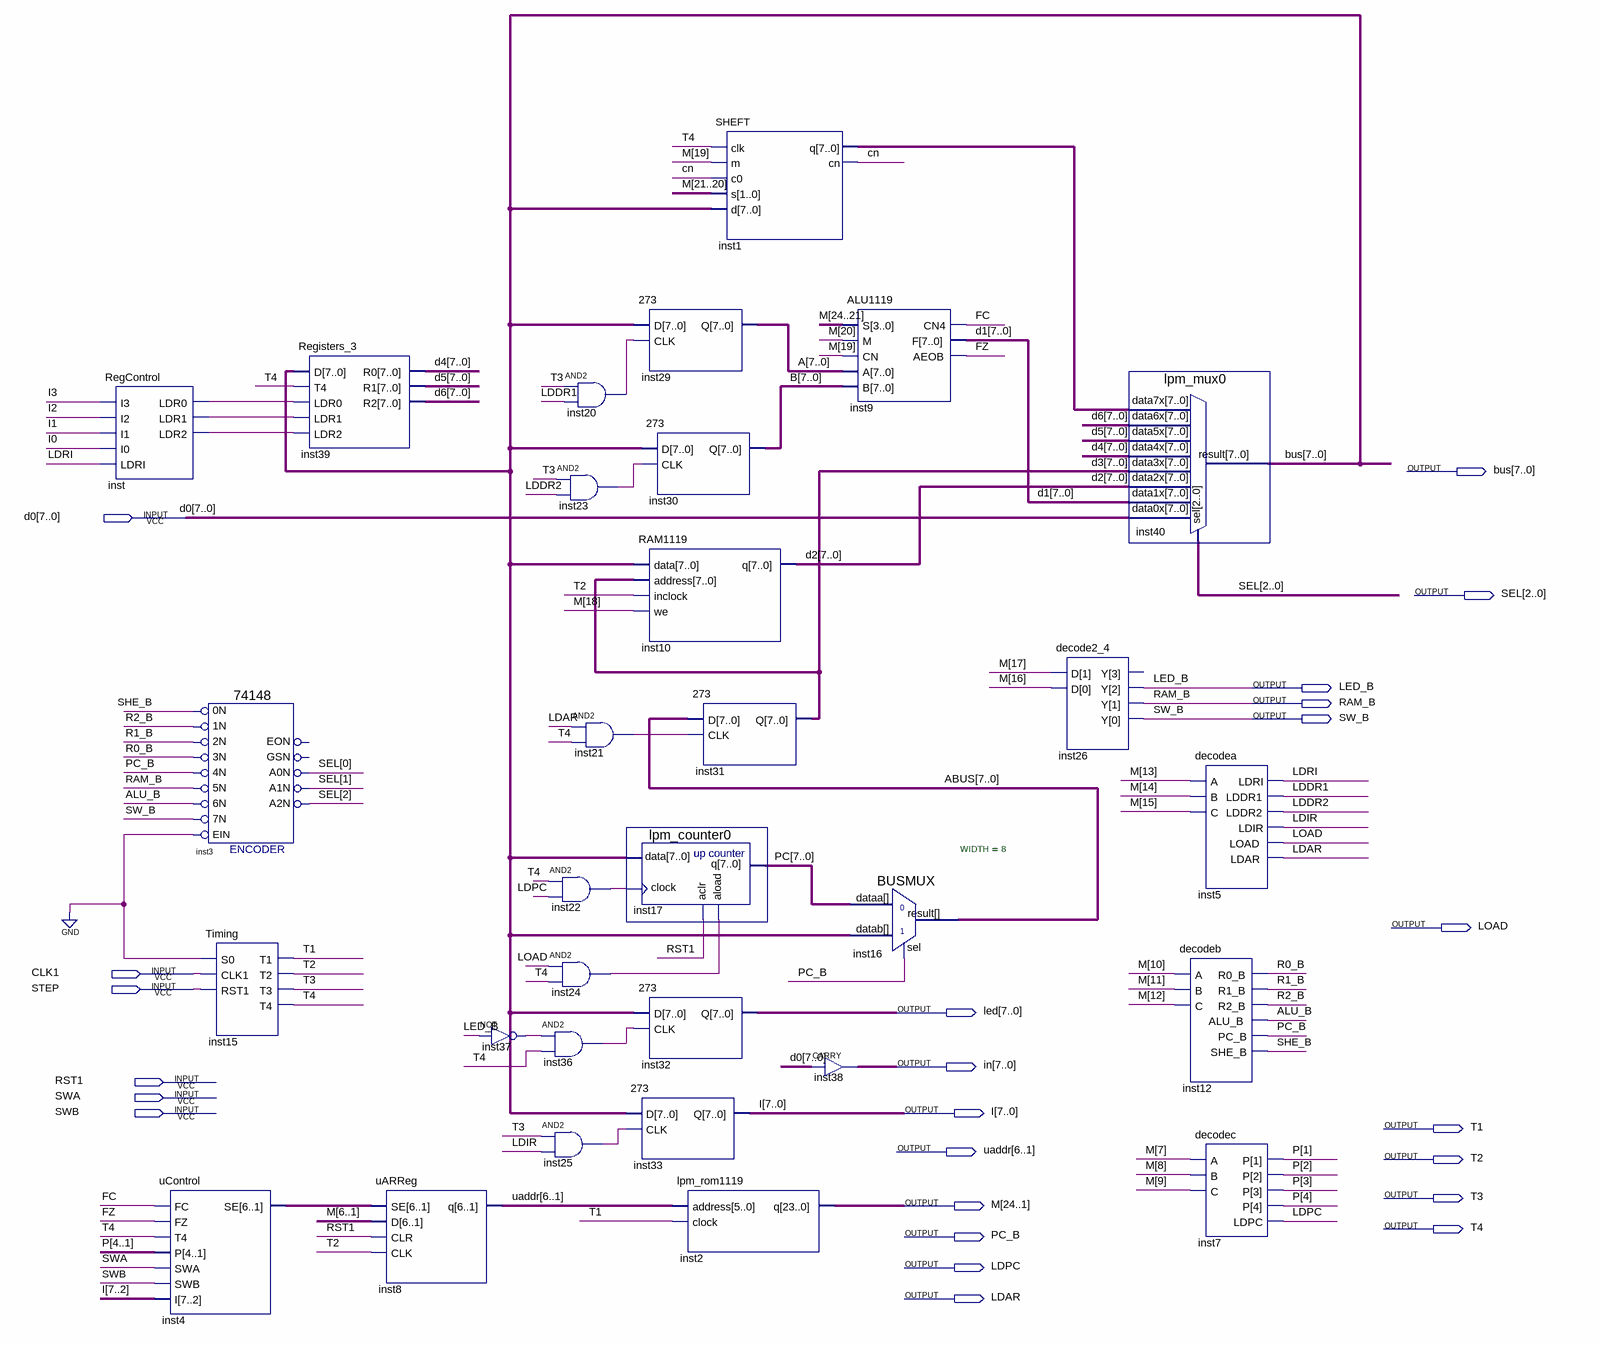
[diagram p0: schematic sheet]
// Quartus schematic move_computer1119.bdf as structural Verilog: 31 symbols, 24 pins
module move_computer1119 (
  input  [7:0] d0,
  input  CLK1,
  input  STEP,
  input  RST1,
  input  SWA,
  input  SWB,
  output [7:0] bus,
  output [2:0] SEL,
  output LED_B,
  output RAM_B,
  output SW_B,
  output LOAD,
  output [7:0] led,
  output [7:0] in,
  output [7:0] I,
  output T1,
  output [6:1] uaddr,
  output T2,
  output T3,
  output [24:1] M,
  output T4,
  output PC_B,
  output LDPC,
  output LDAR
);

  wire ALU_B, cn, FC, FZ, inst20_out, inst21_out, inst22_out, inst23_out, inst24_out, inst25_out, inst36_out,
       inst37_out, inst_ldr0, inst_ldr1, inst_ldr2, LDDR1, LDDR2, LDIR, LDRI, R0_B, R1_B, R2_B, SHE_B;
  wire [4:1] P;
  wire [5:0] inst4_se;
  wire [7:0] A, ABUS, B, d1, d2, d3, d4, d5, d6, inst1_q, PC;
  wire [3:0] inst26_y_open;  // unused outputs

  RegControl inst (
    .I3(I[3]), .I2(I[2]), .I1(I[1]), .I0(I[0]), .LDRI(LDRI), .LDR0(inst_ldr0), .LDR1(inst_ldr1),
    .LDR2(inst_ldr2));
  uControl inst4 (.FC(FC), .FZ(FZ), .T4(T4), .P(P), .SWA(SWA), .SWB(SWB), .I(I[7:2]), .SE(inst4_se));
  \74148  inst3 (
    .\5N (RAM_B), .\0N (SHE_B), .\1N (R2_B), .\2N (R1_B), .\3N (R0_B), .\4N (PC_B), .EIN(1'b0), .\6N (ALU_B),
    .\7N (SW_B), .A1N(SEL[1]), .A0N(SEL[0]), .A2N(SEL[2]));  // open: EON, GSN
  Timing inst15 (.S0(1'b0), .CLK1(CLK1), .RST1(STEP), .T1(T1), .T2(T2), .T3(T3), .T4(T4));
  Registers_3 inst39 (
    .D(bus), .T4(T4), .LDR0(inst_ldr0), .LDR1(inst_ldr1), .LDR2(inst_ldr2), .R0(d4), .R1(d5), .R2(d6));
  uARReg inst8 (.SE(inst4_se), .D(M[6:1]), .CLR(RST1), .CLK(T2), .q(uaddr));
  not inst37 (inst37_out, LED_B);
  and inst20 (inst20_out, T3, LDDR1);
  and inst23 (inst23_out, T3, LDDR2);
  and inst21 (inst21_out, LDAR, T4);
  and inst22 (inst22_out, T4, LDPC);
  and inst24 (inst24_out, LOAD, T4);
  and inst36 (inst36_out, inst37_out, T4);
  and inst25 (inst25_out, T3, LDIR);
  \273  inst29 (.D(bus), .CLK(inst20_out), .Q(A));
  \273  inst30 (.D(bus), .CLK(inst23_out), .Q(B));
  RAM1119 inst10 (.data(bus), .address(d3), .inclock(T2), .we(M[18]), .q(d2));
  lpm_counter0 inst17 (.data(bus), .clock(inst22_out), .aclr(RST1), .aload(inst24_out), .q(PC));
  \273  inst32 (.D(bus), .CLK(inst36_out), .Q(led));
  \273  inst33 (.D(bus), .CLK(inst25_out), .Q(I));
  SHEFT inst1 (.clk(T4), .m(M[19]), .c0(cn), .s(M[21:20]), .d(bus), .q(inst1_q), .cn(cn));
  \273  inst31 (.D(ABUS), .CLK(inst21_out), .Q(d3));
  lpm_rom1119 inst2 (.address(uaddr), .clock(T1), .q(M));
  ALU1119 inst9 (.S(M[24:21]), .M(M[20]), .CN(M[19]), .A(A), .B(B), .CN4(FC), .F(d1), .AEOB(FZ));
  CARRY inst38[7:0] (.IN(d0), .OUT(in));
  BUSMUX #(.WIDTH(8)) inst16 (.datab(bus), .sel(PC_B), .dataa(PC), .result(ABUS));
  decode2_4 inst26 (.D(M[17:16]), .Y({inst26_y_open[3], LED_B, RAM_B, SW_B}));
  lpm_mux0 inst40 (
    .data0x(d0), .data1x(d1), .data2x(d2), .data3x(d3), .data4x(d4), .data5x(d5), .data6x(d6),
    .data7x(inst1_q), .sel(SEL), .result(bus));
  decodea inst5 (
    .A(M[13]), .B(M[14]), .C(M[15]), .LDRI(LDRI), .LDDR1(LDDR1), .LDDR2(LDDR2), .LDIR(LDIR), .LOAD(LOAD),
    .LDAR(LDAR));
  decodeb inst12 (
    .A(M[10]), .B(M[11]), .C(M[12]), .R0_B(R0_B), .R1_B(R1_B), .R2_B(R2_B), .ALU_B(ALU_B), .PC_B(PC_B),
    .SHE_B(SHE_B));
  decodec inst7 (.A(M[7]), .B(M[8]), .C(M[9]), .P(P), .LDPC(LDPC));
endmodule
